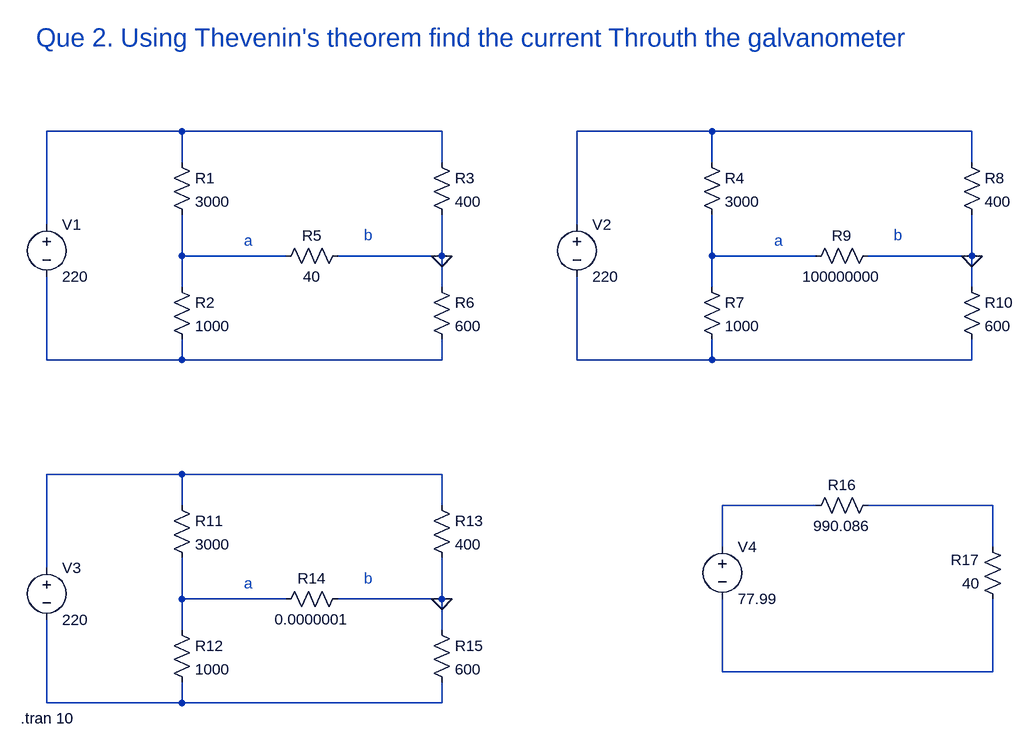
[diagram p0: schematic 2_Dheerendra_23EE019_Thevenins.asc]
2_Dheerendra_23EE019_Thevenins.asc, the LTspice schematic file:
Version 4
SHEET 1 1716 904
WIRE 432 -16 224 -16
WIRE 832 -16 432 -16
WIRE 1248 -16 1040 -16
WIRE 1648 -16 1248 -16
WIRE 432 32 432 -16
WIRE 832 32 832 -16
WIRE 1248 32 1248 -16
WIRE 1648 32 1648 -16
WIRE 224 128 224 -16
WIRE 1040 128 1040 -16
WIRE 432 176 432 112
WIRE 592 176 432 176
WIRE 832 176 832 112
WIRE 832 176 672 176
WIRE 1248 176 1248 112
WIRE 1408 176 1248 176
WIRE 1648 176 1648 112
WIRE 1648 176 1488 176
WIRE 432 224 432 176
WIRE 832 224 832 176
WIRE 1248 224 1248 176
WIRE 1648 224 1648 176
WIRE 224 336 224 208
WIRE 432 336 432 304
WIRE 432 336 224 336
WIRE 832 336 832 304
WIRE 832 336 432 336
WIRE 1040 336 1040 208
WIRE 1248 336 1248 304
WIRE 1248 336 1040 336
WIRE 1648 336 1648 304
WIRE 1648 336 1248 336
WIRE 432 512 224 512
WIRE 832 512 432 512
WIRE 432 560 432 512
WIRE 832 560 832 512
WIRE 1408 560 1264 560
WIRE 1680 560 1488 560
WIRE 1264 624 1264 560
WIRE 1680 624 1680 560
WIRE 224 656 224 512
WIRE 432 704 432 640
WIRE 592 704 432 704
WIRE 832 704 832 640
WIRE 832 704 672 704
WIRE 432 752 432 704
WIRE 832 752 832 704
WIRE 1264 816 1264 704
WIRE 1680 816 1680 704
WIRE 1680 816 1264 816
WIRE 224 864 224 736
WIRE 432 864 432 832
WIRE 432 864 224 864
WIRE 832 864 832 832
WIRE 832 864 432 864
FLAG 1648 176 0
FLAG 832 176 0
FLAG 832 704 0
SYMBOL res 416 16 R0
SYMATTR InstName R1
SYMATTR Value 3000
SYMBOL res 416 208 R0
SYMATTR InstName R2
SYMATTR Value 1000
SYMBOL res 816 16 R0
SYMATTR InstName R3
SYMATTR Value 400
SYMBOL res 688 160 R90
WINDOW 0 0 56 VBottom 2
WINDOW 3 32 56 VTop 2
SYMATTR InstName R5
SYMATTR Value 40
SYMBOL voltage 224 112 R0
WINDOW 123 0 0 Left 0
WINDOW 39 0 0 Left 0
SYMATTR InstName V1
SYMATTR Value 220
SYMBOL res 816 208 R0
SYMATTR InstName R6
SYMATTR Value 600
SYMBOL res 1232 16 R0
SYMATTR InstName R4
SYMATTR Value 3000
SYMBOL res 1232 208 R0
SYMATTR InstName R7
SYMATTR Value 1000
SYMBOL res 1632 16 R0
SYMATTR InstName R8
SYMATTR Value 400
SYMBOL res 1504 160 R90
WINDOW 0 0 56 VBottom 2
WINDOW 3 32 56 VTop 2
SYMATTR InstName R9
SYMATTR Value 100000000
SYMBOL voltage 1040 112 R0
WINDOW 123 0 0 Left 0
WINDOW 39 0 0 Left 0
SYMATTR InstName V2
SYMATTR Value 220
SYMBOL res 1632 208 R0
SYMATTR InstName R10
SYMATTR Value 600
SYMBOL res 416 544 R0
SYMATTR InstName R11
SYMATTR Value 3000
SYMBOL res 416 736 R0
SYMATTR InstName R12
SYMATTR Value 1000
SYMBOL res 816 544 R0
SYMATTR InstName R13
SYMATTR Value 400
SYMBOL res 688 688 R90
WINDOW 0 0 56 VBottom 2
WINDOW 3 32 56 VTop 2
SYMATTR InstName R14
SYMATTR Value 0.0000001
SYMBOL voltage 224 640 R0
WINDOW 123 0 0 Left 0
WINDOW 39 0 0 Left 0
SYMATTR InstName V3
SYMATTR Value 220
SYMBOL res 816 736 R0
SYMATTR InstName R15
SYMATTR Value 600
SYMBOL res 1504 544 R90
WINDOW 0 0 56 VBottom 2
WINDOW 3 32 56 VTop 2
SYMATTR InstName R16
SYMATTR Value 990.086
SYMBOL res 1696 720 R180
WINDOW 0 36 76 Left 2
WINDOW 3 36 40 Left 2
SYMATTR InstName R17
SYMATTR Value 40
SYMBOL voltage 1264 608 R0
WINDOW 123 0 0 Left 0
WINDOW 39 0 0 Left 0
SYMATTR InstName V4
SYMATTR Value 77.99
TEXT 528 152 Left 2 ;a
TEXT 712 144 Left 2 ;b
TEXT 208 -160 Left 4 ;Que 2. Using Thevenin's theorem find the current Throuth the galvanometer
TEXT 1344 152 Left 2 ;a
TEXT 1528 144 Left 2 ;b
TEXT 528 680 Left 2 ;a
TEXT 712 672 Left 2 ;b
TEXT 184 888 Left 2 !.tran 10

The netlist it stands for:
* 2_Dheerendra_23EE019_Thevenins.asc
R1 N001 N003 3000
R2 N003 N005 1000
R3 N001 0 400
R5 0 N003 40
V1 N001 N005 220
R6 0 N005 600
R4 N002 N004 3000
R7 N004 N006 1000
R8 N002 0 400
R9 0 N004 100000000
V2 N002 N006 220
R10 0 N006 600
R11 N007 N010 3000
R12 N010 N012 1000
R13 N007 0 400
R14 0 N010 0.0000001
V3 N007 N012 220
R15 0 N012 600
R16 N009 N008 990.086
R17 N011 N009 40
V4 N008 N011 77.99
* a
* b
* Que 2. Using Thevenin's theorem find the current Throuth the galvanometer
* a
* b
* a
* b
.tran 10
.backanno
.end